# EAGLE design dual_encoder_shield_5v_reva (EAGLE 8.6.0)
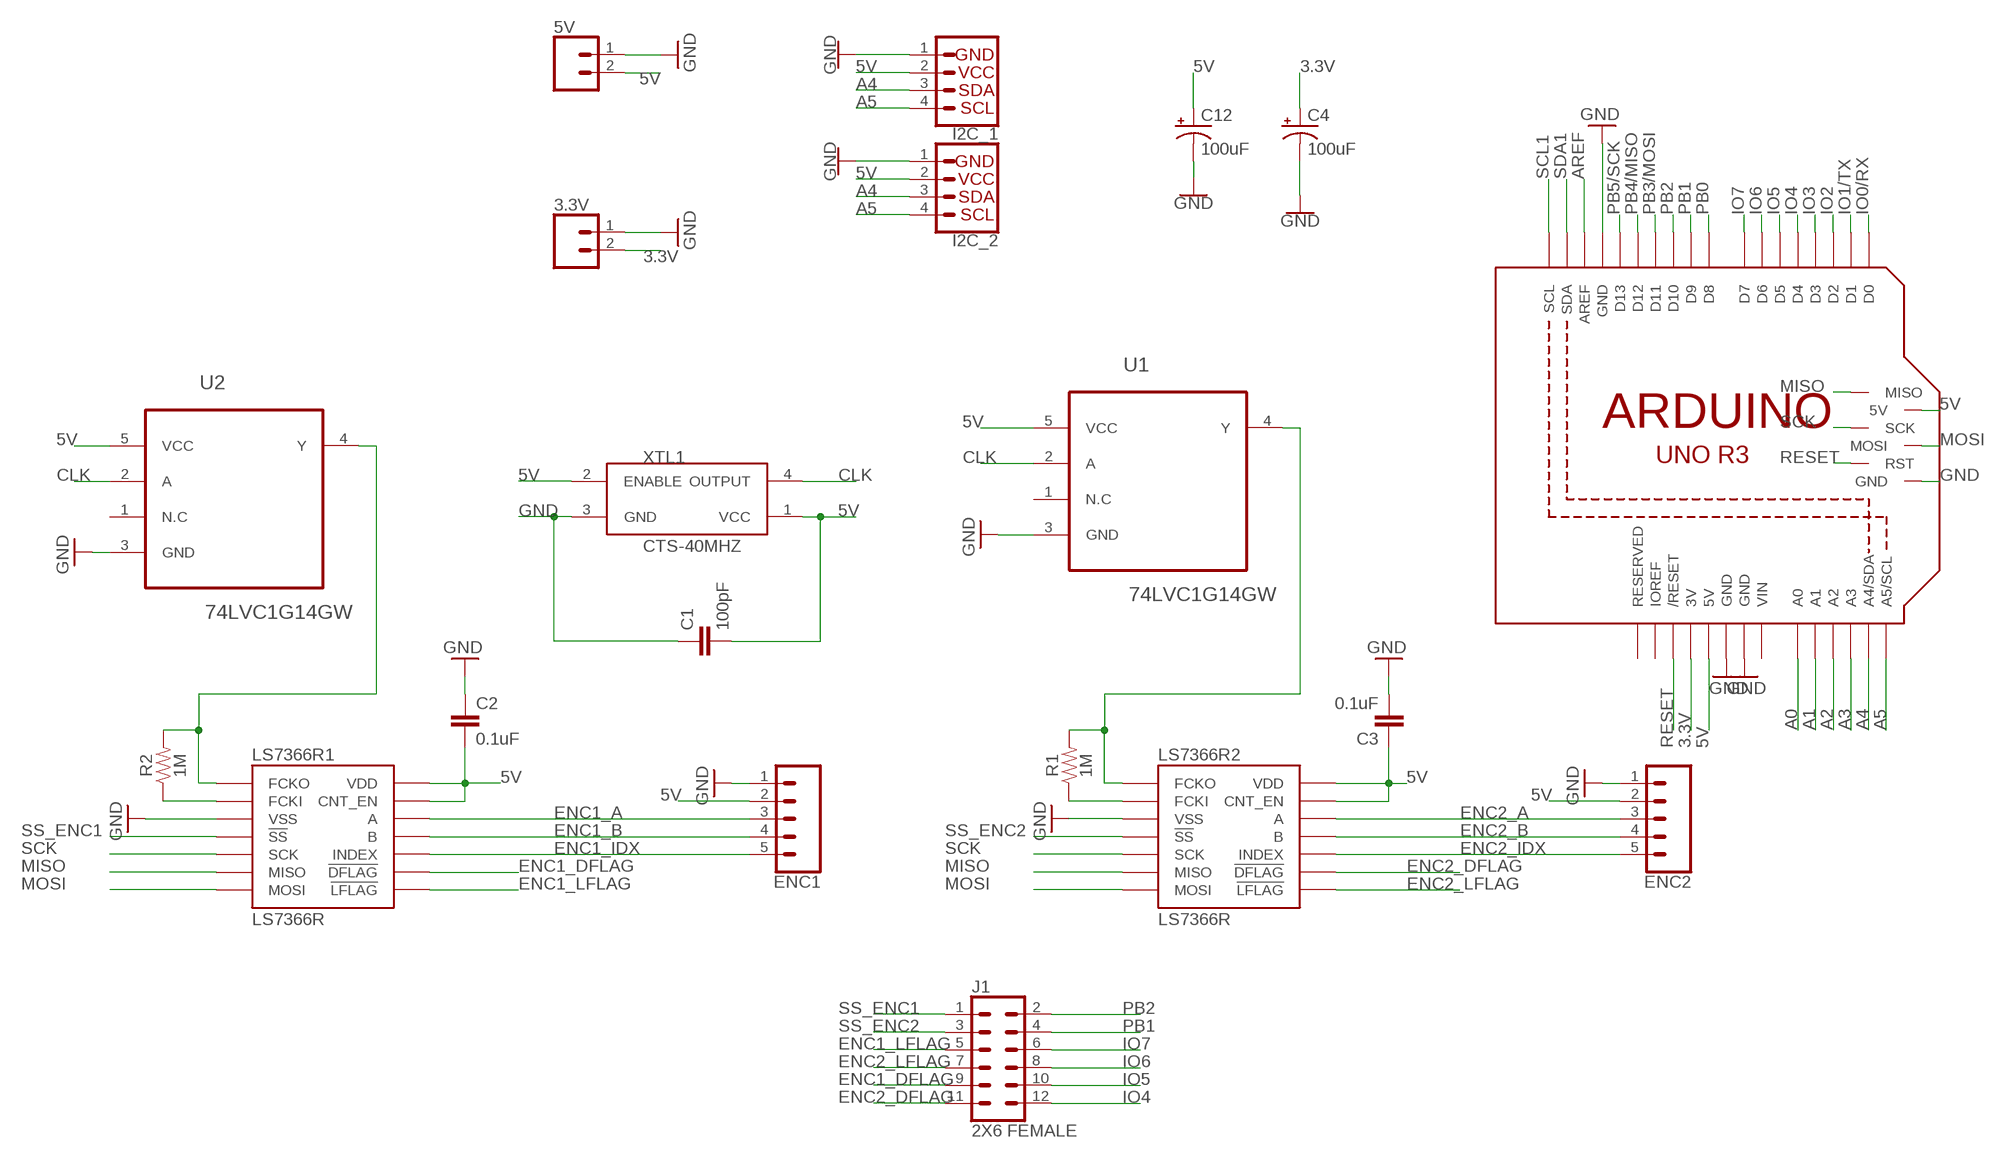
[diagram p0: schematic, sheet 1]

## Parts
3.3V  CONN_02-JST-2MM-SMT  [JST-2-SMD]
5V  CONN_02-JST-2MM-SMT  [JST-2-SMD]
C1  100pF  100PF-0603-50V-5%  [0603]
C2  0.1uF  0.1UF-0603-25V-5%  [0603]
C3  0.1uF  0.1UF-0603-25V-5%  [0603]
C4  100uF  100UF-POLAR-25V-20%(ELEC)  [PANASONIC_D]
C12  100uF  100UF-POLAR-25V-20%(ELEC)  [PANASONIC_D]
ENC1  CONN_05  [1X05]
ENC2  CONN_05  [1X05]
I2C_1  QWIIC_CONNECTORJS-1MM  [JST04_1MM_RA]
I2C_2  QWIIC_CONNECTORJS-1MM  [JST04_1MM_RA]
J1  2X6 FEMALE  CONN_06X2PTH_FEMALE  [2X6]
LS7366R1  LS7366R  [SOIC14]
LS7366R2  LS7366R  [SOIC14]
M1  ARDUINO_R3_ICSP  [ARDUINOR3_ICSP]
R1  1M  1MOHM-0603-1/4W-5%  [0603]
R2  1M  1MOHM-0603-1/4W-5%  [0603]
U1  74LVC1G14GW  [SOT65P210X110-5N]
U2  74LVC1G14GW  [SOT65P210X110-5N]
XTL1  CTS-40MHZ  [SOIC254P1016X440-4N]

## Nets
3.3V: 3.3V.2 C4.+ M1.3V
5V: 5V.2 C1.2 C2.2 C3.1 C12.+ ENC1.2 ENC2.2 I2C_1.2 I2C_2.2 LS7366R1.13(CNT_EN) LS7366R1.14(VDD) LS7366R2.13(CNT_EN) LS7366R2.14(VDD) M1.5V M1.5V_ICSP(5V) U1.5(VCC) U2.5(VCC) XTL1.1(VCC) XTL1.2(ENABLE)
A0: M1.A0
A1: M1.A1
A2: M1.A2
A3: M1.A3
A4: I2C_1.3 I2C_2.3 M1.A4(A4/SDA)
A5: I2C_1.4 I2C_2.4 M1.A5(A5/SCL)
AREF: M1.AREF
CLK: U1.2(A) U2.2(A) XTL1.4(OUTPUT)
ENC1_A: ENC1.3 LS7366R1.12(A)
ENC1_B: ENC1.4 LS7366R1.11(B)
ENC1_DFLAG: J1.9 LS7366R1.9(!DFLAG)
ENC1_IDX: ENC1.5 LS7366R1.10(INDEX)
ENC1_LFLAG: J1.5 LS7366R1.8(!LFLAG)
ENC2_A: ENC2.3 LS7366R2.12(A)
ENC2_B: ENC2.4 LS7366R2.11(B)
ENC2_DFLAG: J1.11 LS7366R2.9(!DFLAG)
ENC2_IDX: ENC2.5 LS7366R2.10(INDEX)
ENC2_LFLAG: J1.7 LS7366R2.8(!LFLAG)
GND: 3.3V.1 5V.1 C1.1 C2.1 C3.2 C4.- C12.- ENC1.1 ENC2.1 I2C_1.1 I2C_2.1 LS7366R1.3(VSS) LS7366R2.3(VSS) M1.GND M1.GND@1(GND) M1.GND@2(GND) M1.GND@3(GND) U1.3(GND) U2.3(GND) XTL1.3(GND)
IO0/RX: M1.D0
IO1/TX: M1.D1
IO2: M1.D2
IO3: M1.D3
IO4: J1.12 M1.D4
IO5: J1.10 M1.D5
IO6: J1.8 M1.D6
IO7: J1.6 M1.D7
MISO: LS7366R1.6(MISO) LS7366R2.6(MISO) M1.MISO
MOSI: LS7366R1.7(MOSI) LS7366R2.7(MOSI) M1.MOSI
N$6: LS7366R1.2(FCKI) R2.1
N$8: LS7366R2.1(FCKO) R1.2 U1.4(Y)
N$9: LS7366R2.2(FCKI) R1.1
N$10: LS7366R1.1(FCKO) R2.2 U2.4(Y)
PB0: M1.D8
PB1: J1.4 M1.D9
PB2: J1.2 M1.D10
PB3/MOSI: M1.D11
PB4/MISO: M1.D12
PB5/SCK: M1.D13
RESET: M1.RESET(/RESET) M1.RESET_ICSP(RST)
SCK: LS7366R1.5(SCK) LS7366R2.5(SCK) M1.SCK
SCL1: M1.SCL
SDA1: M1.SDA
SS_ENC1: J1.1 LS7366R1.4(!SS)
SS_ENC2: J1.3 LS7366R2.4(!SS)
Unconnected: M1.IOREF M1.RESERVED U1.1(N.C) U2.1(N.C)

## Power pins joined to a net without a drawn wire
VIN: M1.VIN

## Library data of the parts
3.3V 5V = SparkFun-Connectors:CONN_02: Multi connection point. Often used as Generic Header-pin footprint for 0.1 inch spaced/style header connections On any of the 0.1 inch spaced packages, you can populate with these: Break Away Headers - Straight <https://www.sparkfun.com/products/116> (PRT-00116) Break Away Male Headers - Right Angle <https://www.sparkfun.com/products/553> (PRT-00553) Female Headers <https://www.sparkfun.com/products/115> (PRT-00115) Break Away Headers - Machine Pin <https://www.sparkfun.com/products/117> (PRT-00117) Break Away Female Headers - Swiss Machine Pin <https://www.sparkfun.com/products/743> (PRT-00743) For SCREWTERMINALS and SPRING TERMINALS visit here: Screw Terimnals on SparkFun.com <https://www.sparkfun.com/search/results?term=Screw+Terminals> (5mm/3.5mm/2.54mm spacing) This device is also useful as a general connection point to wire up your design to another part of your project. Our various solder wires solder well into these plated through hole pads. Hook-Up Wire - Assortment (Stranded, 22 AWG) <https://www.sparkfun.com/products/11375> (PRT-11375) Hook-Up Wire - Assortment (Solid Core, 22 AWG) <https://www.sparkfun.com/products/11367> (PRT-11367) View the entire wire category on our website here <https://www.sparkfun.com/categories/141> Special notes: Molex polarized connector foot print use with: PRT-08233 with associated crimp pins and housings. 2.54_SCREWTERM for use with PRT-10571. 3.5mm Screw Terminal footprints for PRT-08084 5mm Screw Terminal footprints for use with PRT-08432; PROD_ID: CONN-11443
C1 = SparkFun-Capacitors:100PF: 100pF/0.1nF ceramic capacitors A capacitor is a passive two-terminal electrical component used to store electrical energy temporarily in an electric field.; PROD_ID: CAP-07883
C2 C3 = SparkFun-Capacitors:0.1UF: 0.1µF ceramic capacitors A capacitor is a passive two-terminal electrical component used to store electrical energy temporarily in an electric field.; PROD_ID: CAP-08604
C4 C12 = SparkFun-Capacitors:100UF-POLAR: 100µF polarized capacitors A capacitor is a passive two-terminal electrical component used to store electrical energy temporarily in an electric field.; PROD_ID: CAP-12547
ENC1 ENC2 = SparkFun-Connectors:CONN_05: Multi connection point. Often used as Generic Header-pin footprint for 0.1 inch spaced/style header connections On any of the 0.1 inch spaced packages, you can populate with these: Break Away Headers - Straight <https://www.sparkfun.com/products/116> (PRT-00116) Break Away Male Headers - Right Angle <https://www.sparkfun.com/products/553> (PRT-00553) Female Headers <https://www.sparkfun.com/products/115> (PRT-00115) Break Away Headers - Machine Pin <https://www.sparkfun.com/products/117> (PRT-00117) Break Away Female Headers - Swiss Machine Pin <https://www.sparkfun.com/products/743> (PRT-00743) For SCREWTERMINALS and SPRING TERMINALS visit here: Screw Terimnals on SparkFun.com <https://www.sparkfun.com/search/results?term=Screw+Terminals> (5mm/3.5mm/2.54mm spacing) This device is also useful as a general connection point to wire up your design to another part of your project. Our various solder wires solder well into these plated through hole pads. Hook-Up Wire - Assortment (Stranded, 22 AWG) <https://www.sparkfun.com/products/11375> (PRT-11375) Hook-Up Wire - Assortment (Solid Core, 22 AWG) <https://www.sparkfun.com/products/11367> (PRT-11367) View the entire wire category on our website here <https://www.sparkfun.com/categories/141> Special notes: Molex polarized connector foot print use with SKU : PRT-08231 with associated crimp pins and housings. 1MM SMD Version SKU: PRT-10208
I2C_1 I2C_2 = SparkFun-Connectors:QWIIC_CONNECTOR: SparkFun I2C Standard Qwiic Connector An SMD 1mm pitch JST connector makes it easy and quick (get it? Qwiic?) to connect I2C devices to each other. The Qwiic system <http://www.sparkfun.com/qwiic> enables fast and solderless connection between popular platforms and various sensors and actuators. We carry 200mm <https://www.sparkfun.com/products/14204>, 100mm <https://www.sparkfun.com/products/14205>, 50mm <https://www.sparkfun.com/products/14206>, and breadboard friendly <https://www.sparkfun.com/products/14207> Qwiic cables. We also offer 10 pcs strips <https://www.sparkfun.com/products/14323> the SMD connectors.; PROD_ID: CONN-13694
J1 = SparkFun-Connectors:CONN_06X2: Multi connection point. Often used as Generic Header-pin footprint for 0.1 inch spaced/style header connections On any of the 0.1 inch spaced packages, you can populate with these: Break Away Headers - Straight <https://www.sparkfun.com/products/116> (PRT-00116) Break Away Male Headers - Right Angle <https://www.sparkfun.com/products/553> (PRT-00553) Female Headers <https://www.sparkfun.com/products/115> (PRT-00115) Break Away Headers - Machine Pin <https://www.sparkfun.com/products/117> (PRT-00117) Break Away Female Headers - Swiss Machine Pin <https://www.sparkfun.com/products/743> (PRT-00743); PROD_ID: CONN-12423
LS7366R1 LS7366R2 = LS7366R:LS7366R; AVAILABILITY: Unavailable; MF: LSI; MP: LS7366R; PACKAGE: None; PRICE: None
M1 = adafruit:ARDUINO_R3_ICSP
R1 R2 = SparkFun-Resistors:1MOHM: 1MΩ resistor A resistor is a passive two-terminal electrical component that implements electrical resistance as a circuit element. Resistors act to reduce current flow, and, at the same time, act to lower voltage levels within circuits. - Wikipedia; PROD_ID: RES-07868
U1 U2 = 74LVC1G14GW:74LVC1G14GW: Single Schmitt-trigger inverter; AVAILABILITY: Unavailable; DESCRIPTION: IC MOS 74LVC1G14/SO/74LVC1G14GW PHILIPS RoHS LVC SOt23; MF: NXP Semiconductors; MP: 74LVC1G14GW; PACKAGE: TSSOP-5 NXP Semiconductors; PRICE: 214.47 USD
XTL1 = steveo:CTS-40MHZ

## Board
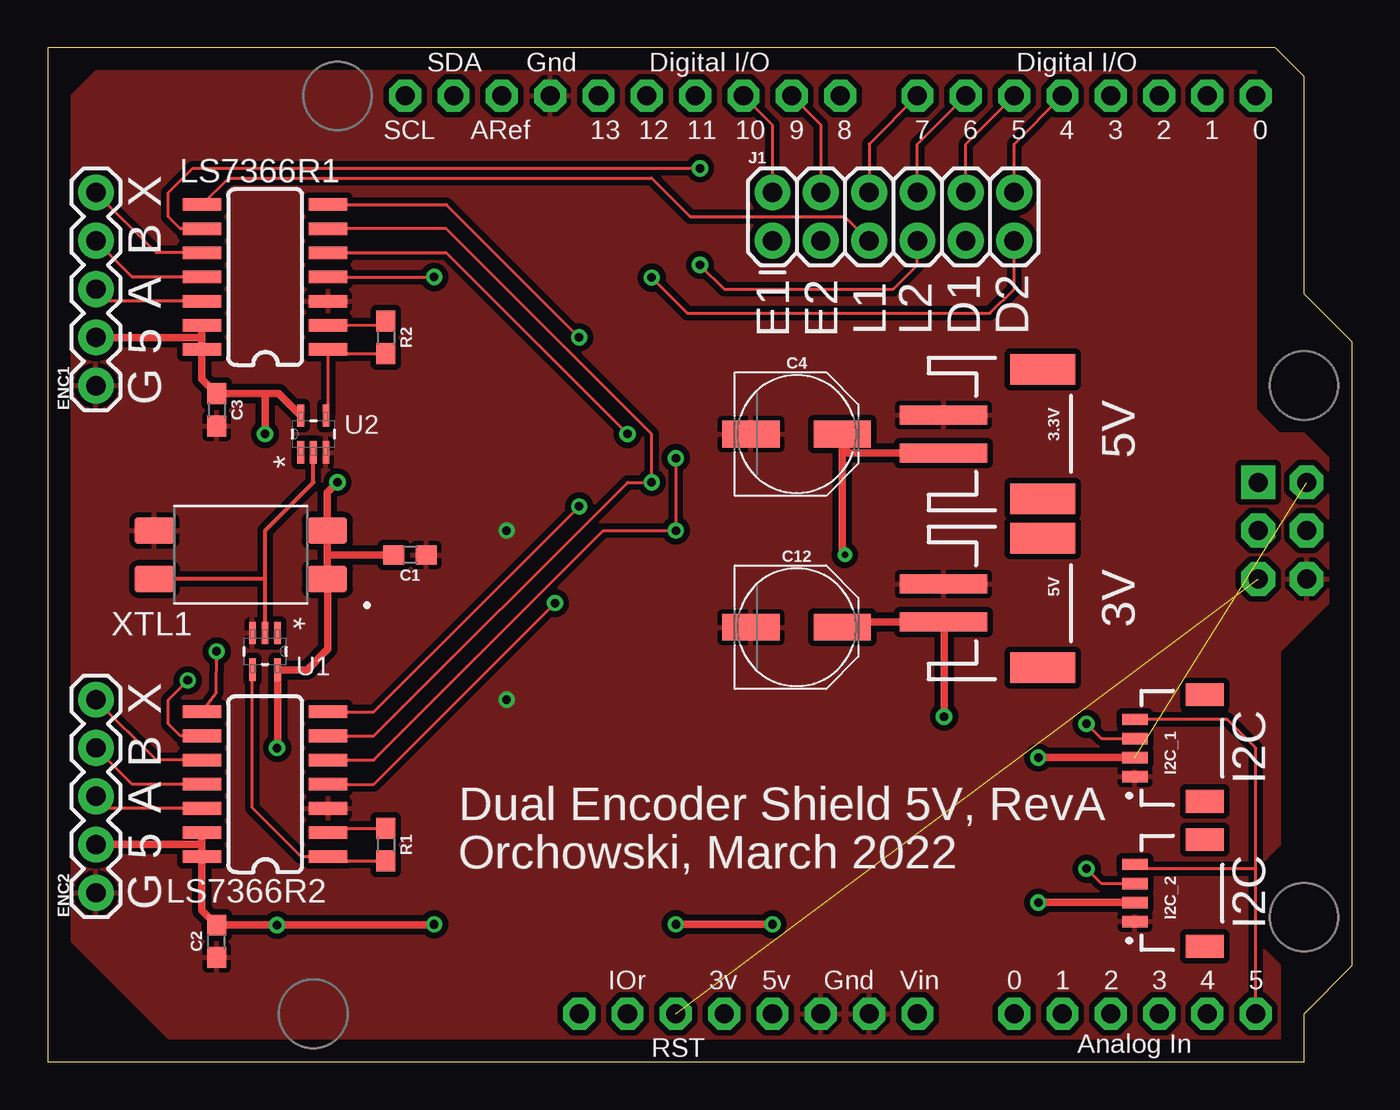
[diagram p1: board, top side]
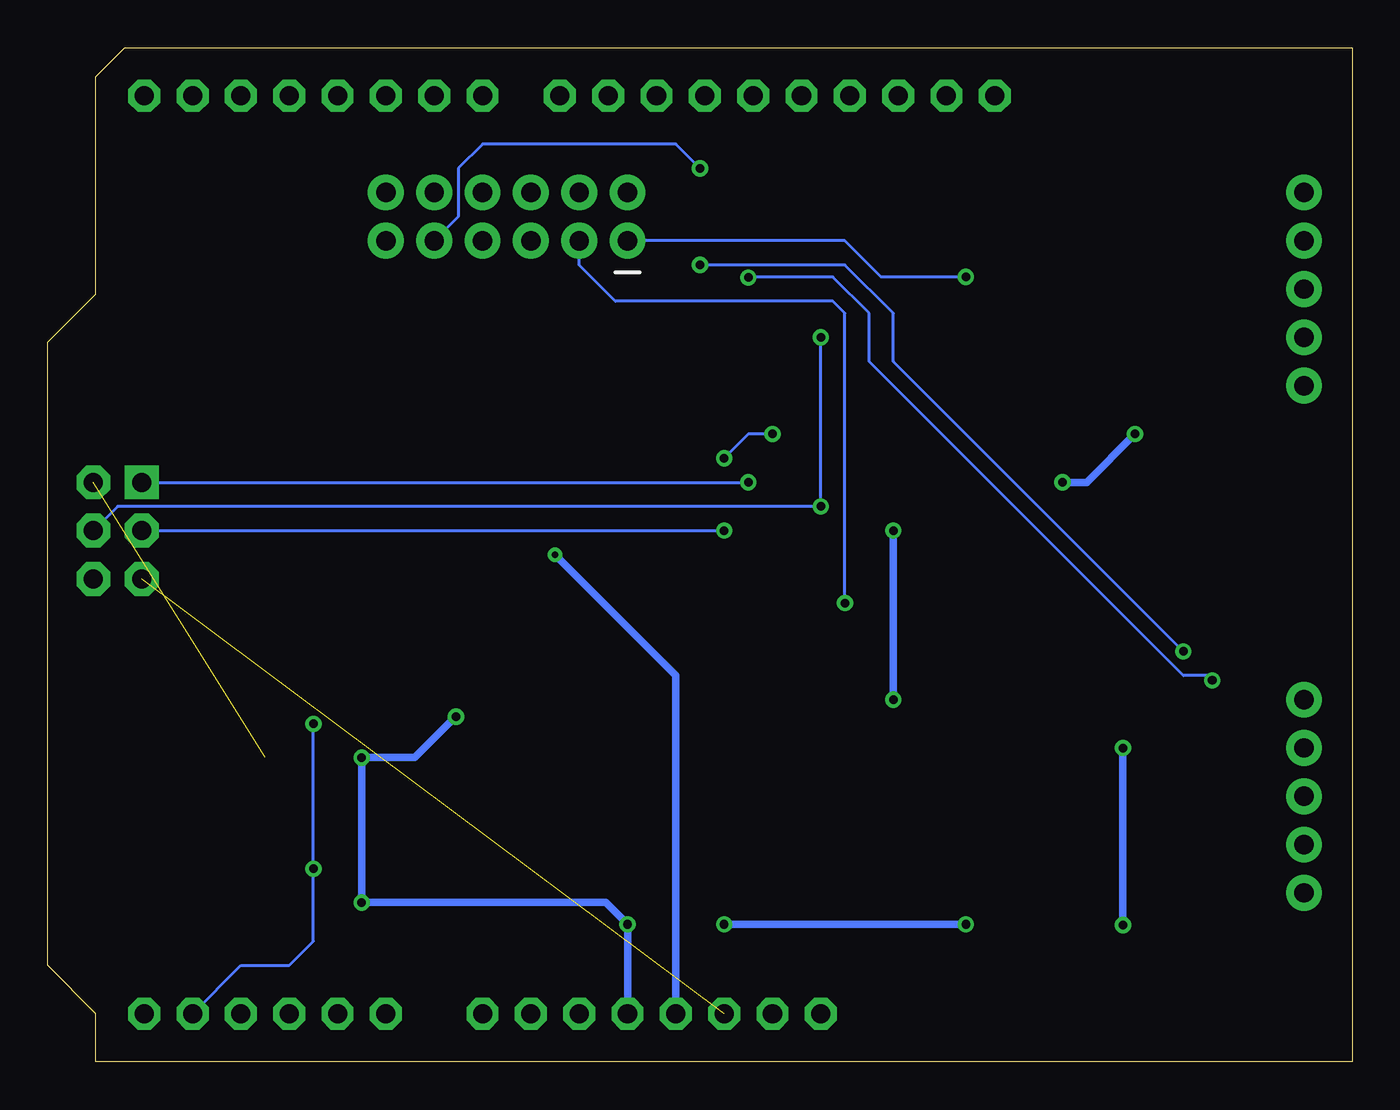
[diagram p2: board, bottom side, seen from below]

Size 68.58 x 53.34 mm. Coordinates in mm from the lower left corner, seen from the top.
Copper layers (1*16): Top 0.035mm / dielectric 1.5mm / Bottom 0.035mm
Design rules "default": minimum track width 6mil, minimum drill 0.35mm, track to track 6mil, track to pad 6mil, pad to pad 6mil, via to via 6mil, smd to smd 6mil, copper to edge 40mil, drill to drill 6mil, minimum pad ring 10mil, minimum via ring 8mil, stop-mask expansion 4mil, vias tented up to drill 0mil, thermal gap 10mil

### Footprints (pad centres in the part's own frame; a part is rotated, then mirrored left to right if it is on the bottom)
JST-2-SMD = smd 1 x 4.6: 1 -1,-3.7; 2 1,-3.7 | smd 1.6 x 3.4: NC1 -3.4,1.5; NC2 3.4,1.5
0603 = smd 1.1 x 1: 1 -0.85,0; 2 0.85,0
PANASONIC_D = smd 3 x 1.4: + 2.4,0; - -2.4,0
1X05 = drill 1.016 pad 1.88: 1 0,0; 2 2.54,0; 3 5.08,0; 4 7.62,0; 5 10.16,0
JST04_1MM_RA = smd 0.6 x 1.35: 1 -1.5,0; 2 -0.5,0; 3 0.5,0; 4 1.5,0 | smd 1.2 x 2: NC1 2.8,-3.675; NC2 -2.8,-3.675
2X6 = drill 1.016 pad 1.88: 1 0,0; 2 0,2.54; 3 2.54,0; 4 2.54,2.54; 5 5.08,0; 6 5.08,2.54; 7 7.62,0; 8 7.62,2.54; 9 10.16,0; 10 10.16,2.54; 11 12.7,0; 12 12.7,2.54
SOIC14 = smd 2.032 x 0.66: 1 -3.315,4.445; 2 -3.315,3.175; 3 -3.315,1.905; 4 -3.315,0.635; 5 -3.315,-0.635; 6 -3.315,-1.905; 7 -3.315,-3.175; 8 3.315,-3.175; 9 3.315,-1.905; 10 3.315,-0.635; 11 3.315,0.635; 12 3.315,1.905; 13 3.315,3.175; 14 3.315,4.445
ARDUINOR3_ICSP = drill 1 pad 1.676 octagon: 3V 35.56,2.54; 5V 38.1,2.54; A0 50.8,2.54; A1 53.34,2.54; A2 55.88,2.54; A3 58.42,2.54; A4 60.96,2.54; A5 63.5,2.54; AREF 23.876,50.8; D0 63.5,50.8; D1 60.96,50.8; D2 58.42,50.8; D3 55.88,50.8; D4 53.34,50.8; D5 50.8,50.8; D6 48.26,50.8; D7 45.72,50.8; D8 41.656,50.8; D9 39.116,50.8; D10 36.576,50.8; D11 34.036,50.8; D12 31.496,50.8; D13 28.956,50.8; GND 26.416,50.8; GND@1 43.18,2.54; GND@2 40.64,2.54; IOREF 30.48,2.54; RESERVED 27.94,2.54; RESET 33.02,2.54; SCL 18.796,50.8; SDA 21.336,50.8; VIN 45.72,2.54 | drill 1 pad 1.778 octagon: 5V_ICSP 66.167,30.48; GND@3 66.167,25.4; MOSI 66.167,27.94; RESET_ICSP 63.627,25.4; SCK 63.627,27.94 | drill 1 pad 1.778 square: MISO 63.627,30.48
SOT65P210X110-5N = smd 1.168 x 0.356: 1 -0.965,0.66; 2 -0.965,0; 3 -0.965,-0.66; 4 0.965,-0.66; 5 0.965,0.66
SOIC254P1016X440-4N = smd 2.09 x 1.39: 1 -4.54,1.27; 2 -4.54,-1.27; 3 4.54,-1.27; 4 4.54,1.27

### Placement (x,y rotation side)
3.3V  50.8,33.02 270 top
5V  50.8,24.13 270 top
C1  19.05,26.67 180 top
C2  8.89,6.35 90 top
C3  8.89,34.29 270 top
C4  39.37,33.02 0 top
C12  39.37,22.86 0 top
ENC1  2.54,35.56 90 top
ENC2  2.54,8.89 90 top
I2C_1  57.15,16.51 90 top
I2C_2  57.15,8.89 90 top
J1  38.1,43.18 0 top
LS7366R1  11.43,41.91 180 top
LS7366R2  11.43,15.24 180 top
M1  0,0 0 top
R1  17.78,11.43 270 top
R2  17.78,38.1 270 top
U1  11.43,21.59 270 top
U2  13.97,33.02 90 top
XTL1  10.16,26.67 180 top

### Tracks (layer width: path | path; a pad name or v marks a point on that pad's centre or on a via)
3.3V  (via drill 0.35)
  Top 0.406: 3.3V.2 42.04,32.02 C4.+ 41.77,26.81 v41.91,26.67
  Bottom 0.406: v41.91,26.67 35.56,20.32 M1.3V
5V  (via drill 0.45)  (1 unrouted)
  Top 0.406: LS7366R1.13 8.12,38.1 | 8.12,38.1 LS7366R1.14 8.12,35.91 C3.1 11.43,35.14 | ENC1.2 8.12,38.1 | LS7366R2.13 8.12,11.43 | 8.12,11.43 LS7366R2.14 8.12,7.97 C2.2 v12.06,7.2 20.28,7.2 v20.32,7.24 | ENC2.2 8.12,11.43 | 14.7,26.67 XTL1.2 14.7,29.94 v15.24,30.48 | 14.7,26.67 XTL1.1 14.73,25.37 14.73,21.72 13.64,20.62 U1.5 12.09,16.54 v12.06,16.51 | 14.7,26.67 C1.2 | 11.43,35.14 12.15,35.14 U2.5 | v11.43,33.02 11.43,35.14 | C12.+ 42.04,23.13 5V.2 | 5V.2 46.99,23.02 | v33.02,7.24 v38.1,7.24 | v52.07,8.38 I2C_2.2 | I2C_1.2 v52.08,16.01 v52.07,16 | v47.12,18.16 47.12,23.11 5V.2
  Bottom 0.406: v15.24,30.48 13.97,30.48 v11.43,33.02 | v12.06,16.51 v12.06,7.2 | v20.32,7.24 v33.02,7.24 | M1.5V v38.1,7.24 39.24,8.38 v52.07,8.38 v52.07,16 49.28,16 v47.12,18.16
A4  (via drill 0.45)
  Top 0.152: v54.61,10.16 55.38,9.39 I2C_2.3 | v54.61,17.78 55.38,17.01 I2C_1.3
  Bottom 0.152: M1.A4 58.42,5.08 55.88,5.08 54.61,6.35 v54.61,10.16 v54.61,17.78
A5
  Top 0.152: 63.5,10.16 57.38,10.16 I2C_2.4 | M1.A5 63.5,10.16 | 63.5,10.16 63.5,16.51 62,18.01 I2C_1.4
CLK
  Top 0.203: U1.2 11.43,25.4 | 11.43,25.4 XTL1.4 | 11.43,25.4 11.43,27.94 13.97,30.48 U2.2
ENC1_A
  Top 0.152: LS7366R1.12 3.17,40.01 ENC1.3
ENC1_B
  Top 0.152: LS7366R1.11 4.45,41.27 ENC1.4
ENC1_DFLAG  (via drill 0.45)
  Top 0.152: LS7366R1.9 6.99,43.81 6.35,44.45 6.35,45.72 7.62,46.99 v34.29,46.99
  Bottom 0.152: v34.29,46.99 35.56,48.26 45.72,48.26 46.99,46.99 46.99,44.45 J1.9
ENC1_IDX
  Top 0.152: LS7366R1.10 5.71,42.55 ENC1.5
ENC1_LFLAG
  Top 0.152: LS7366R1.8 9.51,46.48 31.75,46.48 33.78,44.45 41.91,44.45 J1.5
ENC2_A
  Top 0.152: LS7366R2.12 3.17,13.34 ENC2.3
ENC2_B
  Top 0.152: LS7366R2.11 4.45,14.61 ENC2.4
ENC2_DFLAG  (via drill 0.45)
  Top 0.152: LS7366R2.9 6.99,17.14 6.35,17.78 6.35,19.05 v7.37,20.07 | v31.75,41.25 33.63,39.37 49.53,39.37 50.8,40.64 J1.11
  Bottom 0.152: v7.37,20.07 7.62,20.32 8.89,20.32 25.4,36.83 25.4,39.37 27.3,41.27 31.72,41.27 v31.75,41.25
ENC2_IDX
  Top 0.152: LS7366R2.10 5.71,15.88 ENC2.5
ENC2_LFLAG  (via drill 0.45)
  Top 0.152: LS7366R2.8 8.88,19.42 v8.89,21.59 | v34.29,41.91 35.56,40.64 44.45,40.64 45.72,41.91 J1.7
  Bottom 0.152: v8.89,21.59 24.13,36.83 24.13,39.37 26.67,41.91 v34.29,41.91
GND  (via drill 0.45)
  Bottom 0.406: v24.13,19.05 v24.13,27.94
  pour Top (isolate 0.305): 1.27,48.26 1.27,6.35 6.35,1.27 64.77,1.27 64.77,5.08 63.5,6.35 63.5,10.16 64.77,11.43 64.77,21.59 67.31,24.13 67.31,31.75 66.04,33.02 64.77,33.02 63.5,34.29 63.5,52.07 3.81,52.07 2.54,52.07 1.27,50.8
IO4
  Top 0.152: J1.12 50.8,48.26 M1.D4
IO5
  Top 0.152: J1.10 48.26,48.26 M1.D5
IO6
  Top 0.152: J1.8 45.72,48.26 M1.D6
IO7
  Top 0.152: M1.D7 43.18,48.26 J1.6
MISO  (via drill 0.45)
  Top 0.152: LS7366R1.6 20.95,43.81 31.75,33.02 v31.75,30.48 30.48,30.48 17.14,17.14 LS7366R2.6
  Bottom 0.152: M1.MISO v31.75,30.48
MOSI  (via drill 0.45)
  Top 0.152: LS7366R1.7 20.95,45.09 v27.94,38.1 | LS7366R2.7 17.14,18.41 v27.94,29.21
  Bottom 0.152: M1.MOSI 64.9,29.21 v27.94,29.21 v27.94,38.1
N$6
  Top 0.152: LS7366R1.2 17.57,38.73 R2.1
N$8
  Top 0.152: R1.2 14.96,10.58 LS7366R2.1 13.34,10.79 10.77,13.36 U1.4
N$9
  Top 0.152: LS7366R2.2 14.96,12.28 R1.1
N$10
  Top 0.152: R2.2 14.96,37.25 LS7366R1.1 14.74,34.1 U2.4
PB1
  Top 0.152: M1.D9 40.64,49.28 J1.4
PB2
  Top 0.152: M1.D10 38.1,49.28 J1.2
RESET  (1 unrouted)
SCK  (via drill 0.45)
  Top 0.152: LS7366R1.5 20.95,42.55 v30.48,33.02 | LS7366R2.5 17.14,15.88 29.21,27.94 v33.02,27.94 v33.02,31.75
  Bottom 0.152: M1.SCK v33.02,27.94 | v30.48,33.02 31.75,33.02 v33.02,31.75
SS_ENC1  (via drill 0.45)
  Top 0.152: LS7366R1.4 v20.32,41.27
  Bottom 0.152: v20.32,41.27 24.77,41.27 26.67,43.18 J1.1
SS_ENC2  (via drill 0.45)
  Top 0.152: LS7366R2.4 17.14,14.61 v26.67,24.13
  Bottom 0.152: v26.67,24.13 26.67,39.37 27.3,40.01 38.73,40.01 40.64,41.91 J1.3

### Text on the board
tNames: X | B | A | E1 | E2 | L1 | L2 | D1 | D2 | 5 | G | 5V | 3V | X | B | I2C | A | Dual Encoder Shield 5V, RevA | 5 | Orchowski, March 2022 | G | I2C